# EAGLE design tccs_reader (EAGLE 5.11)
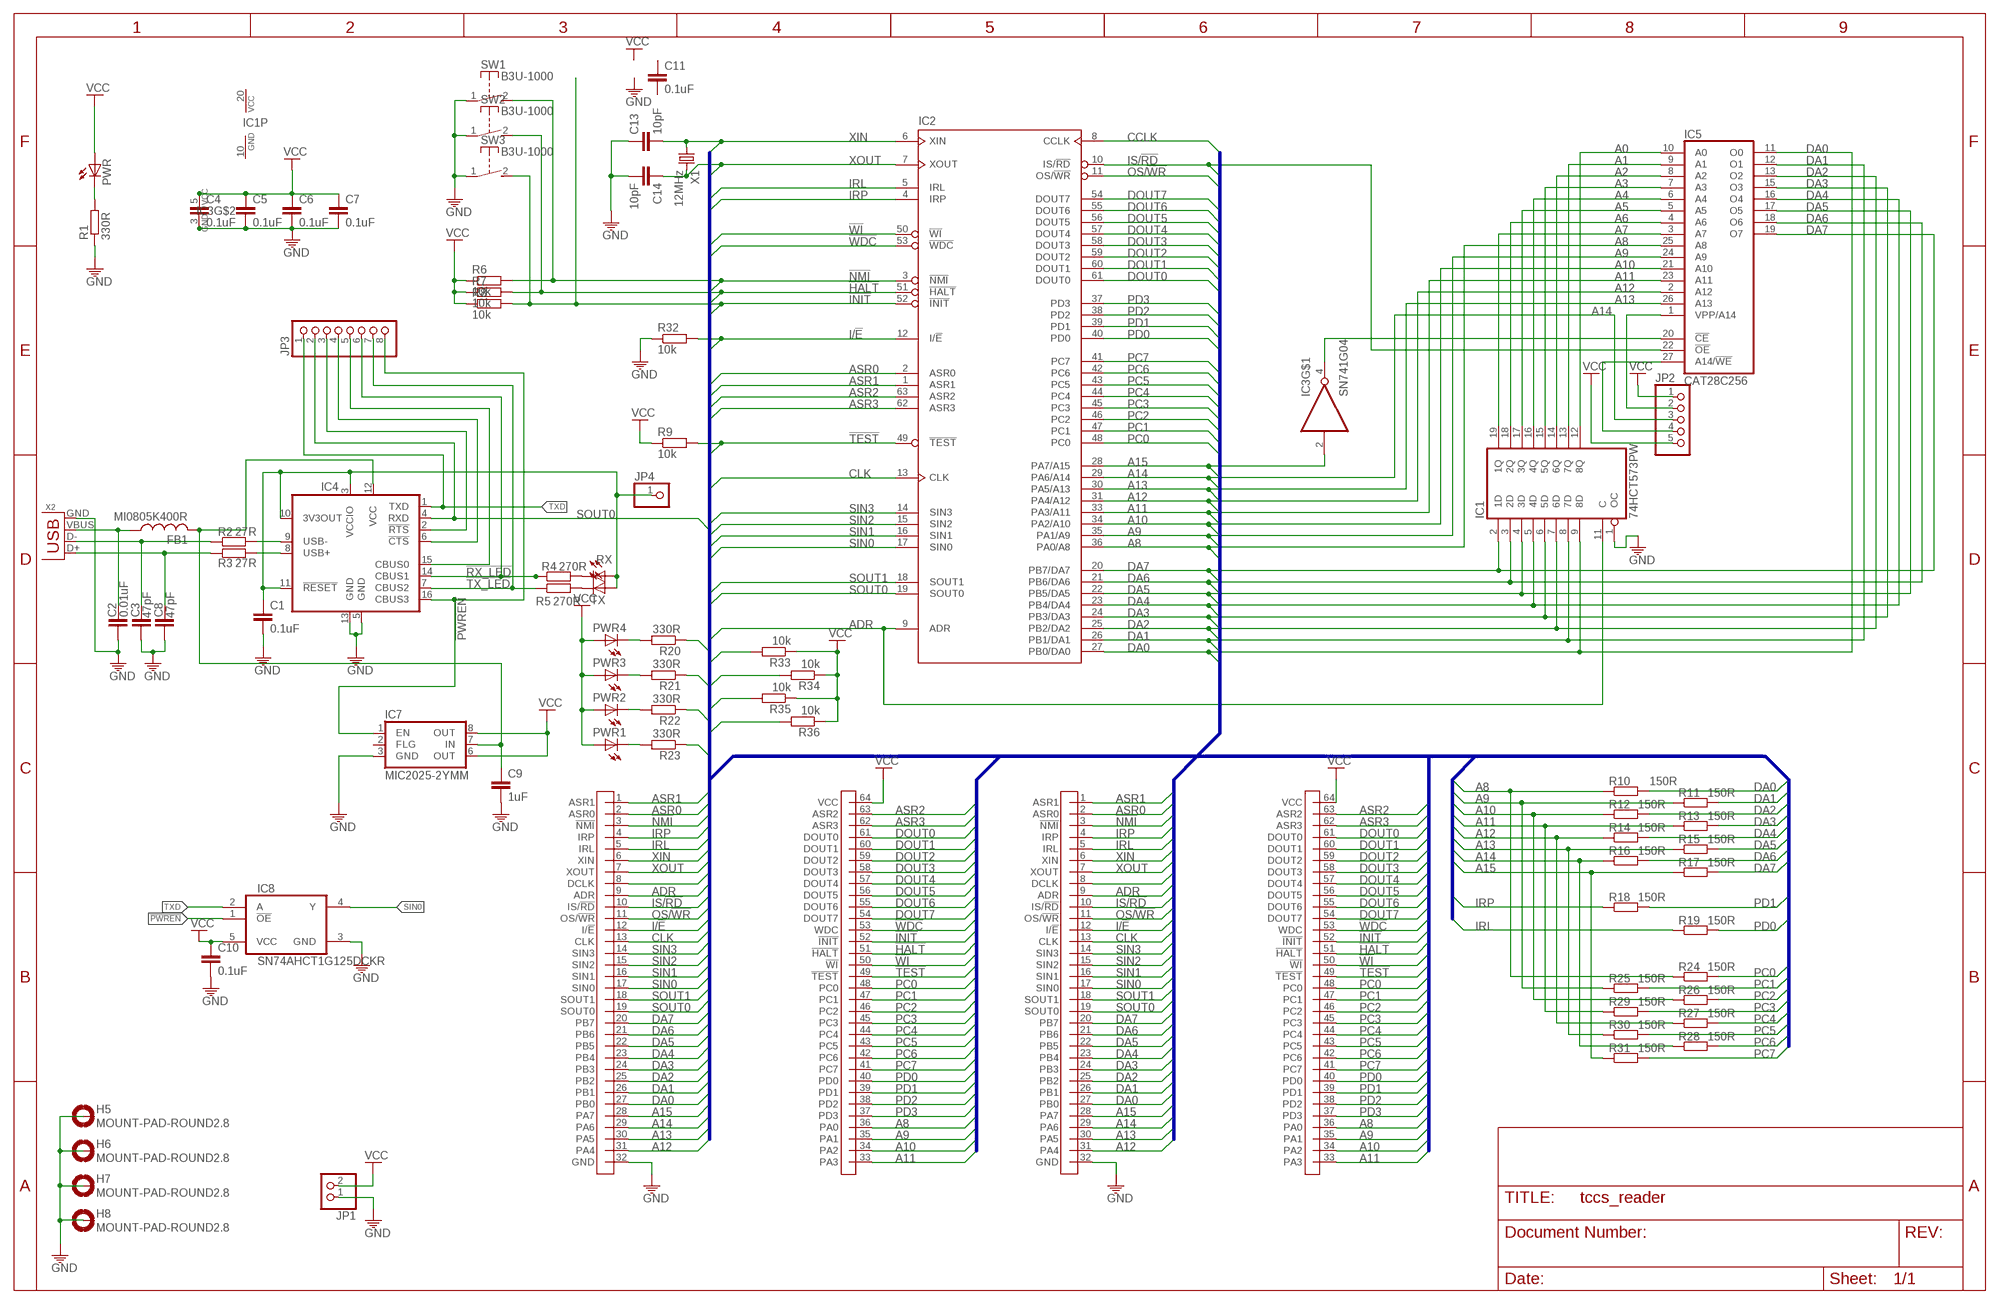
[diagram p0: schematic, sheet 1]

## Parts
C1  0.1uF  C-EUC0603  [C0603]
C2  0.01uF  C-EUC0603  [C0603]
C3  47pF  C-EUC0603  [C0603]
C4  0.1uF  C-EUC0603  [C0603]
C5  0.1uF  C-EUC0603  [C0603]
C6  0.1uF  C-EUC0603  [C0603]
C7  0.1uF  C-EUC0603  [C0603]
C8  47pF  C-EUC0603  [C0603]
C9  1uF  C-EUC0603  [C0603]
C10  0.1uF  C-EUC0603  [C0603]
C11  0.1uF  C-EUC0603  [C0603]
C13  10pF  C-EUC0603  [C0603]
C14  10pF  C-EUC0603  [C0603]
FB1  MI0805K400R  [R0805]
H5  MOUNT-PAD-ROUND2.8  [2,8-PAD]
H6  MOUNT-PAD-ROUND2.8  [2,8-PAD]
H7  MOUNT-PAD-ROUND2.8  [2,8-PAD]
H8  MOUNT-PAD-ROUND2.8  [2,8-PAD]
IC1  74HCT573PW  [PW_R-PDSO-G20]
IC2  D151803-9661  [SDIP-64]
IC3  SN741G04  [DCK_R-PDSO-G5]
IC4  IC_FT230X-SSOP-16  [SSOP-16-FTDI]
IC5  CAT28C256  [PDIP28]
IC6  D151803-HEADER  [SDIP-64-HEADER]
IC7  MIC2025-2YMM  [MSOP8]
IC8  SN74AHCT1G125DCKR  [DCK_R-PDSO-G5]
JP1  PINHD-1X2  [1X02]
JP2  PINHD-1X5  [1X05]
JP3  PINHD-1X8  [1X08]
JP4  PINHD-1X1  [1X01]
PWR  LEDCHIP-LED0603  [CHIP-LED0603]
PWR1  LEDCHIP-LED0603  [CHIP-LED0603]
PWR2  LEDCHIP-LED0603  [CHIP-LED0603]
PWR3  LEDCHIP-LED0603  [CHIP-LED0603]
PWR4  LEDCHIP-LED0603  [CHIP-LED0603]
R1  330R  R-EU_R0603  [R0603]
R2  27R  R-EU_R0603  [R0603]
R3  27R  R-EU_R0603  [R0603]
R4  270R  R-EU_R0603  [R0603]
R5  270R  R-EU_R0603  [R0603]
R6  10k  R-EU_R0603  [R0603]
R7  10k  R-EU_R0603  [R0603]
R8  10k  R-EU_R0603  [R0603]
R9  10k  R-EU_R0603  [R0603]
R10  150R  R-EU_R0603  [R0603]
R11  150R  R-EU_R0603  [R0603]
R12  150R  R-EU_R0603  [R0603]
R13  150R  R-EU_R0603  [R0603]
R14  150R  R-EU_R0603  [R0603]
R15  150R  R-EU_R0603  [R0603]
R16  150R  R-EU_R0603  [R0603]
R17  150R  R-EU_R0603  [R0603]
R18  150R  R-EU_R0603  [R0603]
R19  150R  R-EU_R0603  [R0603]
R20  330R  R-EU_R0603  [R0603]
R21  330R  R-EU_R0603  [R0603]
R22  330R  R-EU_R0603  [R0603]
R23  330R  R-EU_R0603  [R0603]
R24  150R  R-EU_R0603  [R0603]
R25  150R  R-EU_R0603  [R0603]
R26  150R  R-EU_R0603  [R0603]
R27  150R  R-EU_R0603  [R0603]
R28  150R  R-EU_R0603  [R0603]
R29  150R  R-EU_R0603  [R0603]
R30  150R  R-EU_R0603  [R0603]
R31  150R  R-EU_R0603  [R0603]
R32  10k  R-EU_R0603  [R0603]
R33  10k  R-EU_R0603  [R0603]
R34  10k  R-EU_R0603  [R0603]
R35  10k  R-EU_R0603  [R0603]
R36  10k  R-EU_R0603  [R0603]
RX  LEDCHIP-LED0603  [CHIP-LED0603]
SW1  B3U-1000  [B3U-1000]
SW2  B3U-1000  [B3U-1000]
SW3  B3U-1000  [B3U-1000]
TX  LEDCHIP-LED0603  [CHIP-LED0603]
U$3  SDIP64-ZIF  [SDIP-64-ZIF]
X1  12MHz  CRYSTAL5X3  [CRYSTAL-SMD-5X3]
X2  USB-B-H  [USB-B-H]

## Nets
!HALT: IC2.51(:!HALT) IC6.51(!HALT) R7.2 SW2.2(S) U$3.51(!HALT)
!INIT: IC2.52(:!INIT) IC6.52(!INIT) R8.2 SW3.2(S) U$3.52(!INIT)
!NMI: IC2.3(:!NMI) IC6.3(!NMI) R6.2 SW1.2(S) U$3.3(!NMI)
!PWREN: IC4.16(CBUS3) IC7.1(EN) IC8.1(!OE) JP3.8
!RX_LED: IC4.14(CBUS1) JP3.6 R4.1
!TEST: IC2.49(:!TEST) IC6.49(!TEST) R9.2 U$3.49(!TEST)
!TX_LED: IC4.7(CBUS2) JP3.7 R5.1
!WDC: IC2.53(:!WDC) IC6.53(WDC) U$3.53(WDC)
!WI: IC2.50(:!WI) IC6.50(!WI) U$3.50(!WI)
A0: IC1.12(8Q) IC5.10(A0)
A1: IC1.13(7Q) IC5.9(A1)
A2: IC1.14(6Q) IC5.8(A2)
A3: IC1.15(5Q) IC5.7(A3)
A4: IC1.16(4Q) IC5.6(A4)
A5: IC1.17(3Q) IC5.5(A5)
A6: IC1.18(2Q) IC5.4(A6)
A7: IC1.19(1Q) IC5.3(A7)
A8: IC2.36(:PA0/A8) IC5.25(A8) IC6.36(PA0) R10.1 R24.1 U$3.36(PA0)
A9: IC2.35(:PA1/A9) IC5.24(A9) IC6.35(PA1) R11.1 R25.1 U$3.35(PA1)
A10: IC2.34(:PA2/A10) IC5.21(A10) IC6.34(PA2) R12.1 R26.1 U$3.34(PA2)
A11: IC2.33(:PA3/A11) IC5.23(A11) IC6.33(PA3) R13.1 R29.1 U$3.33(PA3)
A12: IC2.31(:PA4/A12) IC5.2(A12) IC6.31(PA4) R14.1 R27.1 U$3.31(PA4)
A13: IC2.30(:PA5/A13) IC5.26(A13) IC6.30(PA5) R15.1 R30.1 U$3.30(PA5)
A14: IC2.29(:PA6/A14) IC6.29(PA6) JP2.3 R16.1 R28.1 U$3.29(PA6)
A15: IC2.28(:PA7/A15) IC3.2(I) IC6.28(PA7) R17.1 R31.1 U$3.28(PA7)
ADR: IC1.11(C) IC2.9(:ADR) IC6.9(ADR) U$3.9(ADR)
ASR0: IC2.2(:ASR0) IC6.2(ASR0) U$3.2(ASR0)
ASR1: IC2.1(:ASR1) IC6.1(ASR1) U$3.1(ASR1)
ASR2: IC2.63(:ASR2) IC6.63(ASR2) U$3.63(ASR2)
ASR3: IC2.62(:ASR3) IC6.62(ASR3) U$3.62(ASR3)
CCLK: IC2.8(:CCLK) IC6.8(DCLK) U$3.8(DCLK)
CLK: IC2.13(:CLK) IC6.13(CLK) U$3.13(CLK)
DA0: IC1.9(8D) IC2.27(:PB0/DA0) IC5.11(O0) IC6.27(PB0) R10.2 U$3.27(PB0)
DA1: IC1.8(7D) IC2.26(:PB1/DA1) IC5.12(O1) IC6.26(PB1) R11.2 U$3.26(PB1)
DA2: IC1.7(6D) IC2.25(:PB2/DA2) IC5.13(O2) IC6.25(PB2) R12.2 U$3.25(PB2)
DA3: IC1.6(5D) IC2.24(:PB3/DA3) IC5.15(O3) IC6.24(PB3) R13.2 U$3.24(PB3)
DA4: IC1.5(4D) IC2.23(:PB4/DA4) IC5.16(O4) IC6.23(PB4) R14.2 U$3.23(PB4)
DA5: IC1.4(3D) IC2.22(:PB5/DA5) IC5.17(O5) IC6.22(PB5) R15.2 U$3.22(PB5)
DA6: IC1.3(2D) IC2.21(:PB6/DA6) IC5.18(O6) IC6.21(PB6) R16.2 U$3.21(PB6)
DA7: IC1.2(1D) IC2.20(:PB7/DA7) IC5.19(O7) IC6.20(PB7) R17.2 U$3.20(PB7)
DOUT0: IC2.61(:DOUT0) IC6.61(DOUT0) R20.1 U$3.61(DOUT0)
DOUT1: IC2.60(:DOUT1) IC6.60(DOUT1) R21.1 U$3.60(DOUT1)
DOUT2: IC2.59(:DOUT2) IC6.59(DOUT2) R22.1 U$3.59(DOUT2)
DOUT3: IC2.58(:DOUT3) IC6.58(DOUT3) R23.1 U$3.58(DOUT3)
DOUT4: IC2.57(:DOUT4) IC6.57(DOUT4) R33.2 U$3.57(DOUT4)
DOUT5: IC2.56(:DOUT5) IC6.56(DOUT5) R34.2 U$3.56(DOUT5)
DOUT6: IC2.55(:DOUT6) IC6.55(DOUT6) R35.2 U$3.55(DOUT6)
DOUT7: IC2.54(:DOUT7) IC6.54(DOUT7) R36.2 U$3.54(DOUT7)
GND: C1.2 C2.2 C3.2 C4.2 C5.2 C6.2 C7.2 C8.2 C9.2 C10.2 C13.1 C14.2 H5.B2,8(MOUNT) H6.B2,8(MOUNT) H7.B2,8(MOUNT) H8.B2,8(MOUNT) IC1.1(OC) IC3.3(GND) IC4.5(GND) IC4.13(GND) IC6.32(GND) IC7.3(GND) IC8.3(GND) JP1.1 R1.1 R32.1 SW1.1(P) SW2.1(P) SW3.1(P) U$3.32(GND) X2.GND
I/!E: IC2.12(:I/!E) IC6.12(I/!E) R32.2 U$3.12(I/!E)
IRL: IC2.5(:IRL) IC6.5(IRL) R19.1 U$3.5(IRL)
IRP: IC2.4(:IRP) IC6.4(IRP) R18.1 U$3.4(IRP)
IS/!RD: IC2.10(:IS/!RD) IC5.22(!OE) IC6.10(IS/!RD) U$3.10(IS/!RD)
N$3: IC4.9(USB-) R2.2
N$4: IC4.8(USB+) R3.2
N$5: C3.1 R2.1 X2.D-
N$6: C8.1 R3.1 X2.D+
N$8: PWR1.C R23.2
N$9: R4.2 RX.C
N$10: R5.2 TX.C
N$11: IC3.4(O) IC5.20(!CE)
N$12: C2.1 FB1.1 X2.VBUS
N$13: IC5.27(A14/!WE) JP2.4
N$14: PWR2.C R22.2
N$15: PWR3.C R21.2
N$16: PWR4.C R20.2
N$17: IC5.1(VPP/A14) JP2.2
N$19: IC4.2(!RTS) JP3.3
N$20: IC4.6(!CTS) JP3.4
N$21: IC4.15(CBUS0) JP3.5
N$43: PWR.C R1.2
OS/!WR: IC2.11(:OS/!WR) IC6.11(OS/!WR) U$3.11(OS/!WR)
PC0: IC2.48(:PC0) IC6.48(PC0) R24.2 U$3.48(PC0)
PC1: IC2.47(:PC1) IC6.47(PC1) R25.2 U$3.47(PC1)
PC2: IC2.46(:PC2) IC6.46(PC2) R26.2 U$3.46(PC2)
PC3: IC2.45(:PC3) IC6.45(PC3) R29.2 U$3.45(PC3)
PC4: IC2.44(:PC4) IC6.44(PC4) R27.2 U$3.44(PC4)
PC5: IC2.43(:PC5) IC6.43(PC5) R30.2 U$3.43(PC5)
PC6: IC2.42(:PC6) IC6.42(PC6) R28.2 U$3.42(PC6)
PC7: IC2.41(:PC7) IC6.41(PC7) R31.2 U$3.41(PC7)
PD0: IC2.40(:PD0) IC6.40(PD0) R19.2 U$3.40(PD0)
PD1: IC2.39(:PD1) IC6.39(PD1) R18.2 U$3.39(PD1)
PD2: IC2.38(:PD2) IC6.38(PD2) U$3.38(PD2)
PD3: IC2.37(:PD3) IC6.37(PD3) U$3.37(PD3)
SIN0: IC2.17(:SIN0) IC6.17(SIN0) IC8.4(Y) U$3.17(SIN0)
SIN1: IC2.16(:SIN1) IC6.16(SIN1) U$3.16(SIN1)
SIN2: IC2.15(:SIN2) IC6.15(SIN2) U$3.15(SIN2)
SIN3: IC2.14(:SIN3) IC6.14(SIN3) U$3.14(SIN3)
SOUT0: IC2.19(:SOUT0) IC4.4(RXD) IC6.19(SOUT0) JP3.2 U$3.19(SOUT0)
SOUT1: IC2.18(:SOUT1) IC6.18(SOUT1) U$3.18(SOUT1)
TXD: IC4.1(TXD) IC8.2(A) JP3.1
VCC: C4.1 C5.1 C6.1 C7.1 C10.1 IC3.5(VCC) IC6.64(VCC) IC7.6(OUT) IC7.8(OUT) IC8.5(VCC) JP1.2 JP2.1 JP2.5 PWR1.A PWR2.A PWR3.A PWR4.A PWR.A R6.1 R7.1 R8.1 R9.1 R33.1 R34.1 R35.1 R36.1 U$3.64(VCC)
VCC_3V3: C1.1 IC4.3(VCCIO) IC4.10(3V3OUT) IC4.11(!RESET) JP4.1 RX.A TX.A
VCC_USB: C9.1 FB1.2 IC4.12(VCC) IC7.7(IN)
XIN: C13.2 IC2.6(:XIN) IC6.6(XIN) U$3.6(XIN) X1.1
XOUT: C14.1 IC2.7(:XOUT) IC6.7(XOUT) U$3.7(XOUT) X1.3
Unconnected: C11.1 C11.2 IC7.2(FLG)

## Buses
CPU:P[1..64],XIN,XOUT,IRP,IRL,!WI,!WDC,!NMI,!HALT,!INIT,I/!E,ASR[0..3],!TEST,CLK,SIN[0..3],SOUT[0..1],ADR,CCLK,IS/!RD,OS/!WR,DOUT[0..7],PD[0..3],PC[0..7],A[8..15],DA[0..7]

## Power pins joined to a net without a drawn wire
GND: IC1.10(GND) IC2.32(P:GND) IC5.14(GND)
VCC: IC1.20(VCC) IC2.64(P:VCC) IC5.28(VCC)

## Library data of the parts
C1-C11 C13 C14 = tccs_reader:C-EU: CAPACITOR, European symbol
FB1 = tccs_reader:MI0805K400R
H5-H8 = holes:MOUNT-PAD-ROUND: MOUNTING PAD, round
IC1 = tccs_reader:74*573: 8-bit D latch BUS DRIVER
IC2 = tccs_reader:D151803-9661
IC3 = tccs_reader:SN74*1G04
IC4 = tccs_reader:IC_FT230X: BASIC USB to UART IC
IC5 = tccs_reader:CAT28C256
IC6 = tccs_reader:D151803-HEADER
IC7 = tccs_reader:MIC2025-2
IC8 = tccs_reader:SN74AHCT1G125
JP1 = pinhead:PINHD-1X2: PIN HEADER
JP2 = pinhead:PINHD-1X5: PIN HEADER
JP3 = pinhead:PINHD-1X8: PIN HEADER
JP4 = pinhead:PINHD-1X1: PIN HEADER
PWR PWR1-PWR4 RX TX = tccs_reader:LED: LED OSRAM: - CHIPLED LG R971, LG N971, LY N971, LG Q971, LY Q971, LO R971, LY R971 LH N974, LH R974 LS Q976, LO Q976, LY Q976 LO Q996 - Hyper CHIPLED LW Q18S LB Q993, LB Q99A, LB R99A - SideLED LS A670, LO A670, LY A670, LG A670, LP A670 LB A673, LV A673, LT A673, LW A673 LH A674 LY A675 LS A676, LA A676, LO A676, LY A676, LW A676 LS A679, LY A679, LG A679 - Hyper Micro SIDELED® LS Y876, LA Y876, LO Y876, LY Y876 LT Y87S - SmartLED LW L88C, LW L88S LB L89C, LB L89S, LG L890 LS L89K, LO L89K, LY L89K LS L896, LA L896, LO L896, LY L896 - TOPLED LS T670, LO T670, LY T670, LG T670, LP T670 LSG T670, LSP T670, LSY T670, LOP T670, LYG T670 LG T671, LOG T671, LSG T671 LB T673, LV T673, LT T673, LW T673 LH T674 LS T676, LA T676, LO T676, LY T676, LB T676, LH T676, LSB T676, LW T676 LB T67C, LV T67C, LT T67C, LS T67K, LO T67K, LY T67K, LW E67C LS E67B, LA E67B, LO E67B, LY E67B, LB E67C, LV E67C, LT E67C LW T67C LS T679, LY T679, LG T679 LS T770, LO T770, LY T770, LG T770, LP T770 LB T773, LV T773, LT T773, LW T773 LH T774 LS E675, LA E675, LY E675, LS T675 LS T776, LA T776, LO T776, LY T776, LB T776 LHGB T686 LT T68C, LB T68C - Hyper Mini TOPLED® LB M676 - Mini TOPLED Santana® LG M470 LS M47K, LO M47K, LY M47K Source: http://www.osram.convergy.de LUXEON: - LUMILED® LXK2-PW12-R00, LXK2-PW12-S00, LXK2-PW14-U00, LXK2-PW14-V00 LXK2-PM12-R00, LXK2-PM12-S00, LXK2-PM14-U00 LXK2-PE12-Q00, LXK2-PE12-R00, LXK2-PE12-S00, LXK2-PE14-T00, LXK2-PE14-U00 LXK2-PB12-K00, LXK2-PB12-L00, LXK2-PB12-M00, LXK2-PB14-N00, LXK2-PB14-P00, LXK2-PB14-Q00 LXK2-PR12-L00, LXK2-PR12-M00, LXK2-PR14-Q00, LXK2-PR14-R00 LXK2-PD12-Q00, LXK2-PD12-R00, LXK2-PD12-S00 LXK2-PH12-R00, LXK2-PH12-S00 LXK2-PL12-P00, LXK2-PL12-Q00, LXK2-PL12-R00 Source: www.luxeon.com KINGBRIGHT: KA-3528ASYC Source: www.kingbright.com
R1-R36 = tccs_reader:R-EU_: RESISTOR, European symbol
SW1-SW3 = tccs_reader:B3U-1000
U$3 = tccs_reader:SDIP64-ZIF
X1 = tccs_reader:CRYSTAL: Crystals Various standard crystals. Proven footprints. Spark Fun Electronics SKU : COM-00534
X2 = tccs_reader:USB: USB Connectors

## Board
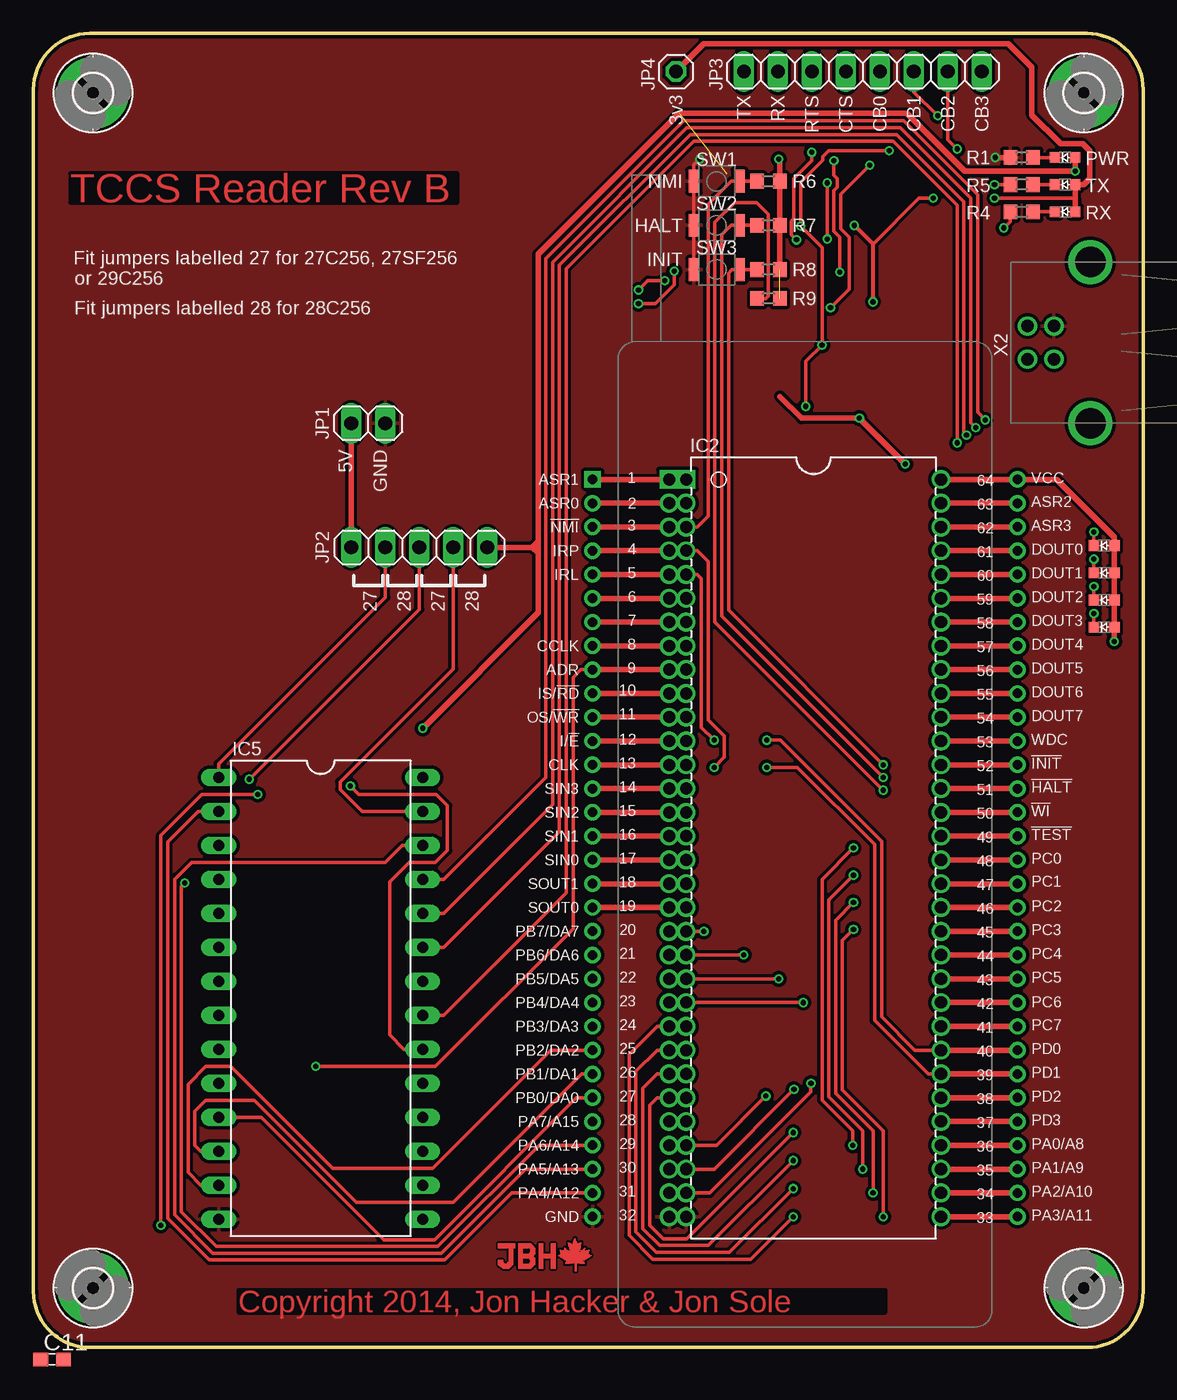
[diagram p1: board, top side]
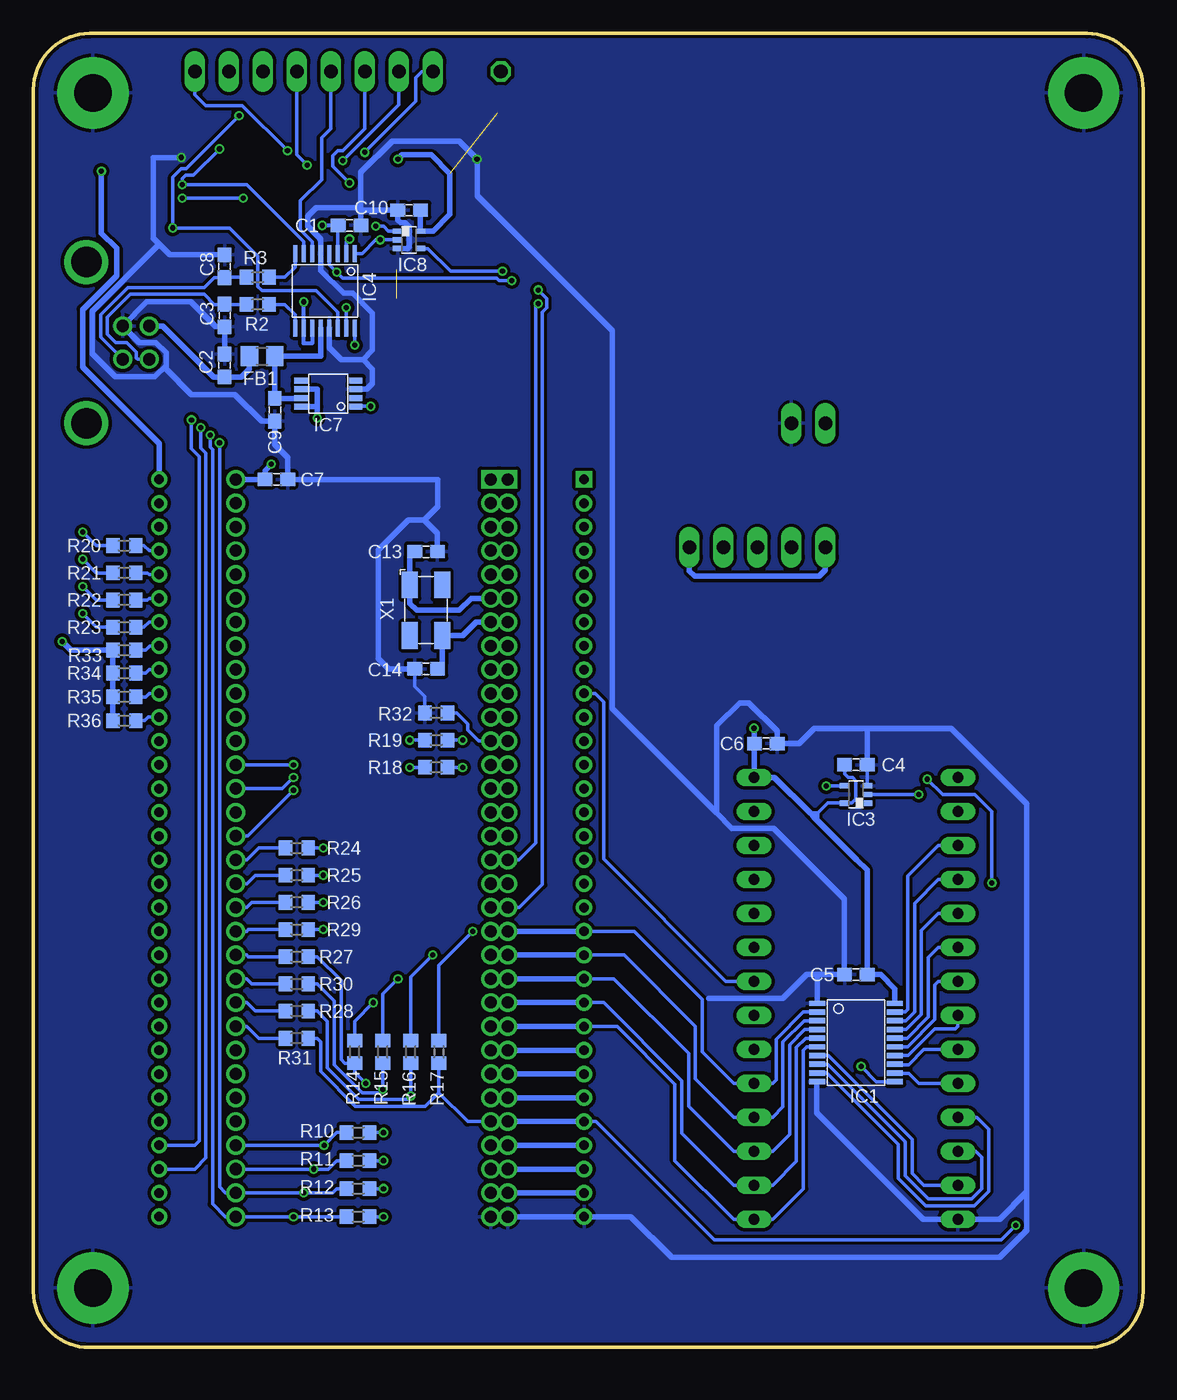
[diagram p2: board, bottom side, seen from below]

Size 82.93 x 98.23 mm. Coordinates in mm from the lower left corner, seen from the top.
Outline: 82.93,4.19 arc-90 78.74,0 4.19,0 arc-90 0,4.19 0,94.04 arc-90 4.19,98.23 78.74,98.23 arc-90 82.93,94.04 82.93,4.19
Copper layers (1*16): Top 0.035mm / dielectric 1.5mm / Bottom 0.035mm
Design rules "elecrow": minimum track width 6mil, minimum drill 12mil, track to track 6mil, track to pad 6mil, pad to pad 6mil, via to via 6mil, smd to smd 0mil, copper to edge 10mil, drill to drill 10mil, minimum pad ring 10mil, minimum via ring 6mil, stop-mask expansion 2mil, vias tented up to drill 100mil, thermal gap 10mil

### Footprints (pad centres in the part's own frame; a part is rotated, then mirrored left to right if it is on the bottom)
C0603 = smd 1.1 x 1: 1 -0.85,0; 2 0.85,0
R0805 = smd 1.3 x 1.5: 1 -0.95,0; 2 0.95,0
2,8-PAD = drill 2.8 pad 5.334 round: B2,8 0,0
PW_R-PDSO-G20 = smd 0.4 x 1.2: 1 -2.925,-2.9; 2 -2.275,-2.9; 3 -1.625,-2.9; 4 -0.975,-2.9; 5 -0.325,-2.9; 6 0.325,-2.9; 7 0.975,-2.9; 8 1.625,-2.9; 9 2.275,-2.9; 10 2.925,-2.9; 11 2.925,2.9; 12 2.275,2.9; 13 1.625,2.9; 14 0.975,2.9; 15 0.325,2.9; 16 -0.325,2.9; 17 -0.975,2.9; 18 -1.625,2.9; 19 -2.275,2.9; 20 -2.925,2.9
SDIP-64 = drill 0.9 square: 1 -27.559,-9.525 | drill 0.9 round: 2 -25.781,-9.525; 3 -24.003,-9.525; 4 -22.225,-9.525; 5 -20.447,-9.525; 6 -18.669,-9.525; 7 -16.891,-9.525; 8 -15.113,-9.525; 9 -13.335,-9.525; 10 -11.557,-9.525; 11 -9.779,-9.525; 12 -8.001,-9.525; 13 -6.223,-9.525; 14 -4.445,-9.525; 15 -2.667,-9.525; 16 -0.889,-9.525; 17 0.889,-9.525; 18 2.667,-9.525; 19 4.445,-9.525; 20 6.223,-9.525; 21 8.001,-9.525; 22 9.779,-9.525; 23 11.557,-9.525; 24 13.335,-9.525; 25 15.113,-9.525; 26 16.891,-9.525; 27 18.669,-9.525; 28 20.447,-9.525; 29 22.225,-9.525; 30 24.003,-9.525; 31 25.781,-9.525; 32 27.559,-9.525; 33 27.559,9.525; 34 25.781,9.525; 35 24.003,9.525; 36 22.225,9.525; 37 20.447,9.525; 38 18.669,9.525; 39 16.891,9.525; 40 15.113,9.525; 41 13.335,9.525; 42 11.557,9.525; 43 9.779,9.525; 44 8.001,9.525; 45 6.223,9.525; 46 4.445,9.525; 47 2.667,9.525; 48 0.889,9.525; 49 -0.889,9.525; 50 -2.667,9.525; 51 -4.445,9.525; 52 -6.223,9.525; 53 -8.001,9.525; 54 -9.779,9.525; 55 -11.557,9.525; 56 -13.335,9.525; 57 -15.113,9.525; 58 -16.891,9.525; 59 -18.669,9.525; 60 -20.447,9.525; 61 -22.225,9.525; 62 -24.003,9.525; 63 -25.781,9.525; 64 -27.559,9.525
DCK_R-PDSO-G5 = smd 0.4 x 0.7: 1 -0.65,-0.85; 2 0,-0.85; 3 0.65,-0.85; 4 0.65,0.85; 5 -0.65,0.85
SSOP-16-FTDI = smd 0.32 x 1.26: 1 -2.223,-2.779; 2 -1.588,-2.779; 3 -0.953,-2.779; 4 -0.318,-2.779; 5 0.317,-2.779; 6 0.952,-2.779; 7 1.587,-2.779; 8 2.222,-2.779; 9 2.222,2.779; 10 1.587,2.779; 11 0.952,2.779; 12 0.317,2.779; 13 -0.318,2.779; 14 -0.953,2.779; 15 -1.588,2.779; 16 -2.223,2.779
PDIP28 = drill 0.813 long: 1 -16.51,-7.62; 2 -13.97,-7.62; 3 -11.43,-7.62; 4 -8.89,-7.62; 5 -6.35,-7.62; 6 -3.81,-7.62; 7 -1.27,-7.62; 8 1.27,-7.62; 9 3.81,-7.62; 10 6.35,-7.62; 11 8.89,-7.62; 12 11.43,-7.62; 13 13.97,-7.62; 14 16.51,-7.62; 15 16.51,7.62; 16 13.97,7.62; 17 11.43,7.62; 18 8.89,7.62; 19 6.35,7.62; 20 3.81,7.62; 21 1.27,7.62; 22 -1.27,7.62; 23 -3.81,7.62; 24 -6.35,7.62; 25 -8.89,7.62; 26 -11.43,7.62; 27 -13.97,7.62; 28 -16.51,7.62
SDIP-64-HEADER = drill 0.711 square: 1 -27.559,-15.875 | drill 0.711 round: 2 -25.781,-15.875; 3 -24.003,-15.875; 4 -22.225,-15.875; 5 -20.447,-15.875; 6 -18.669,-15.875; 7 -16.891,-15.875; 8 -15.113,-15.875; 9 -13.335,-15.875; 10 -11.557,-15.875; 11 -9.779,-15.875; 12 -8.001,-15.875; 13 -6.223,-15.875; 14 -4.445,-15.875; 15 -2.667,-15.875; 16 -0.889,-15.875; 17 0.889,-15.875; 18 2.667,-15.875; 19 4.445,-15.875; 20 6.223,-15.875; 21 8.001,-15.875; 22 9.779,-15.875; 23 11.557,-15.875; 24 13.335,-15.875; 25 15.113,-15.875; 26 16.891,-15.875; 27 18.669,-15.875; 28 20.447,-15.875; 29 22.225,-15.875; 30 24.003,-15.875; 31 25.781,-15.875; 32 27.559,-15.875; 33 27.559,15.875; 34 25.781,15.875; 35 24.003,15.875; 36 22.225,15.875; 37 20.447,15.875; 38 18.669,15.875; 39 16.891,15.875; 40 15.113,15.875; 41 13.335,15.875; 42 11.557,15.875; 43 9.779,15.875; 44 8.001,15.875; 45 6.223,15.875; 46 4.445,15.875; 47 2.667,15.875; 48 0.889,15.875; 49 -0.889,15.875; 50 -2.667,15.875; 51 -4.445,15.875; 52 -6.223,15.875; 53 -8.001,15.875; 54 -9.779,15.875; 55 -11.557,15.875; 56 -13.335,15.875; 57 -15.113,15.875; 58 -16.891,15.875; 59 -18.669,15.875; 60 -20.447,15.875; 61 -22.225,15.875; 62 -24.003,15.875; 63 -25.781,15.875; 64 -27.559,15.875
MSOP8 = smd 0.45 x 1: 1 -0.975,-2.05; 2 -0.325,-2.05; 3 0.325,-2.05; 4 0.975,-2.05; 5 0.975,2.05; 6 0.325,2.05; 7 -0.325,2.05; 8 -0.975,2.05
1X02 = drill 1.016 long: 1 -1.27,0; 2 1.27,0
1X05 = drill 1.016 long: 1 -5.08,0; 2 -2.54,0; 3 0,0; 4 2.54,0; 5 5.08,0
1X08 = drill 1.016 long: 1 -8.89,0; 2 -6.35,0; 3 -3.81,0; 4 -1.27,0; 5 1.27,0; 6 3.81,0; 7 6.35,0; 8 8.89,0
1X01 = drill 1.016 octagon: 1 0,0
CHIP-LED0603 = smd 0.8 x 0.8: A 0,-0.75; C 0,0.75
R0603 = smd 1 x 1.1: 1 -0.85,0; 2 0.85,0
B3U-1000 = smd 0.8 x 1.7: 1 -1.7,0; 2 1.7,0
SDIP-64-ZIF = drill 0.9 square: 1 -27.559,-10.16 | drill 0.9 round: 2 -25.781,-10.16; 3 -24.003,-10.16; 4 -22.225,-10.16; 5 -20.447,-10.16; 6 -18.669,-10.16; 7 -16.891,-10.16; 8 -15.113,-10.16; 9 -13.335,-10.16; 10 -11.557,-10.16; 11 -9.779,-10.16; 12 -8.001,-10.16; 13 -6.223,-10.16; 14 -4.445,-10.16; 15 -2.667,-10.16; 16 -0.889,-10.16; 17 0.889,-10.16; 18 2.667,-10.16; 19 4.445,-10.16; 20 6.223,-10.16; 21 8.001,-10.16; 22 9.779,-10.16; 23 11.557,-10.16; 24 13.335,-10.16; 25 15.113,-10.16; 26 16.891,-10.16; 27 18.669,-10.16; 28 20.447,-10.16; 29 22.225,-10.16; 30 24.003,-10.16; 31 25.781,-10.16; 32 27.559,-10.16; 33 27.559,10.16; 34 25.781,10.16; 35 24.003,10.16; 36 22.225,10.16; 37 20.447,10.16; 38 18.669,10.16; 39 16.891,10.16; 40 15.113,10.16; 41 13.335,10.16; 42 11.557,10.16; 43 9.779,10.16; 44 8.001,10.16; 45 6.223,10.16; 46 4.445,10.16; 47 2.667,10.16; 48 0.889,10.16; 49 -0.889,10.16; 50 -2.667,10.16; 51 -4.445,10.16; 52 -6.223,10.16; 53 -8.001,10.16; 54 -9.779,10.16; 55 -11.557,10.16; 56 -13.335,10.16; 57 -15.113,10.16; 58 -16.891,10.16; 59 -18.669,10.16; 60 -20.447,10.16; 61 -22.225,10.16; 62 -24.003,10.16; 63 -25.781,10.16; 64 -27.559,10.16
CRYSTAL-SMD-5X3 = smd 2 x 1.2: 1 -1.9,-1.2; 2 1.9,-1.2; 3 1.9,1.2; 4 -1.9,1.2
USB-B-H = drill 0.914 round: D+ 0,1.25; D- 1.981,1.25; GND 0,-1.25; VBUS 1.981,-1.25 | drill 2.286 round: P$1 -2.718,-6.02; P$2 -2.718,6.02

### Placement (x,y rotation side)
C1  59.31,83.88 0 bottom
C2  68.64,73.41 90 bottom
C3  68.64,77.15 270 bottom
C4  21.46,43.56 0 bottom
C5  21.46,27.88 180 bottom
C6  28.19,45.15 0 bottom
C7  64.77,64.9 0 bottom
C8  68.64,80.84 90 bottom
C9  64.9,70.1 270 bottom
C10  54.86,85.03 180 bottom
C11  1.4,-0.89 0 top
C13  53.59,59.5 180 bottom
C14  53.59,50.74 180 bottom
FB1  65.85,74.1 0 bottom
H5  78.49,93.79 0 top
H6  4.45,93.79 0 top
H7  78.49,4.44 270 top
H8  4.45,4.44 270 top
IC1  21.46,22.8 270 bottom
IC2  58.29,37.34 270 top
IC3  21.46,41.34 90 bottom
IC4  61.15,78.99 180 bottom
IC5  21.46,26.1 270 top
IC6  57.66,37.34 270 top
IC7  60.9,71.31 90 bottom
IC8  54.86,82.8 270 bottom
JP1  25.02,69.09 180 top
JP2  28.83,59.82 0 top
JP3  61.98,95.38 0 top
JP4  48.01,95.38 0 top
PWR  77.09,88.96 90 top
PWR1  80.01,53.85 90 top
PWR2  80.01,55.88 90 top
PWR3  80.01,57.91 90 top
PWR4  80.01,59.94 90 top
R1  73.85,88.96 0 top
R2  66.17,77.98 0 bottom
R3  66.17,80.01 0 bottom
R4  73.85,84.9 0 top
R5  73.85,86.93 0 top
R6  54.93,87.19 180 top
R7  54.93,83.88 180 top
R8  54.93,80.58 180 top
R9  54.93,78.42 180 top
R10  58.67,16.07 0 bottom
R11  58.67,13.97 0 bottom
R12  58.67,11.87 0 bottom
R13  58.67,9.78 0 bottom
R14  58.93,22.1 90 bottom
R15  56.83,22.1 90 bottom
R16  54.74,22.1 90 bottom
R17  52.64,22.1 90 bottom
R18  52.83,43.37 180 bottom
R19  52.83,45.4 180 bottom
R20  76.14,59.94 180 bottom
R21  76.14,57.91 180 bottom
R22  76.14,55.88 180 bottom
R23  76.14,53.85 180 bottom
R24  63.25,37.34 180 bottom
R25  63.25,35.31 180 bottom
R26  63.25,33.27 180 bottom
R27  63.25,29.21 180 bottom
R28  63.25,25.15 180 bottom
R29  63.25,31.24 180 bottom
R30  63.25,27.18 180 bottom
R31  63.25,23.11 180 bottom
R32  52.83,47.43 0 bottom
R33  76.14,52.13 0 bottom
R34  76.14,50.42 0 bottom
R35  76.14,48.64 0 bottom
R36  76.14,46.86 0 bottom
RX  77.09,84.9 90 top
SW1  51.05,87.19 0 top
SW2  51.05,83.88 0 top
SW3  51.05,80.58 0 top
TX  77.09,86.93 90 top
U$1  [JBH_LOGO]  34.29,5.59 0 top
U$3  57.66,37.34 270 top
X1  53.59,55.12 270 bottom
X2  76.26,75.12 180 top

### Tracks (layer width: path | path; a pad name or v marks a point on that pad's centre or on a via)
!HALT  (via drill 0.38)
  Top 0.254: v63.5,42.61 51.43,54.67 51.43,83.19 52.13,83.88 SW2.2 R7.2
  Top 0.406: U$3.51 IC6.51
  Bottom 0.254: v63.5,42.61 64.33,41.78 U$3.51
!INIT  (via drill 0.38)
  Top 0.254: v63.5,43.56 51.94,55.12 51.94,80.33 52.2,80.58 SW3.2 R8.2
  Top 0.406: U$3.52 IC6.52
  Bottom 0.254: v63.5,43.56 U$3.52
!NMI
  Top 0.254: R6.2 SW1.2 52.13,87.19 50.42,85.47 50.42,62.17 49.59,61.34 IC2.3
  Top 0.406: IC6.3 U$3.3 IC2.3
!PWREN  (via drill 0.38)
  Top 0.254: v57.72,70.36 57.72,73.72 v58.93,74.93 58.93,82.23 v57.34,83.82 57.34,87.12 58.99,88.77 58.99,89.03 59.44,89.47 v63.95,89.47
  Bottom 0.254: v57.72,70.36 58.82,70.36 IC7.1 | IC4.16 v58.93,74.93 | IC8.1 56.4,83.45 56.77,83.82 v57.34,83.82 | v63.95,89.47 67.31,92.84 70.04,92.84 70.87,93.66 JP3.8
!RX_LED  (via drill 0.38)
  Top 0.254: R4.1 73,84.18 v72.52,83.69 | JP3.6 65.79,93.85 v67.56,92.08
  Bottom 0.254: IC4.14 60.2,77.41 61.79,78.99 65.85,78.99 66.17,79.31 66.17,81.6 68.26,83.69 v72.52,83.69 72.52,87.5 71.88,88.14 71.5,88.14 v67.56,92.08
!TEST  (via drill 0.38)
  Top 0.254: v63.5,41.66 50.93,54.23 50.93,84.14 52.39,85.6 54.04,85.6 54.93,84.71 54.93,78.61 54.74,78.42 R9.2
  Top 0.406: U$3.49 IC6.49
  Bottom 0.254: v63.5,41.66 66.93,38.23 U$3.49
!TX_LED  (via drill 0.38)
  Top 0.254: v71.82,86.93 R5.1 | v69.02,89.6 68.33,90.3 JP3.7
  Bottom 0.254: IC4.7 62.74,82.68 66.99,86.93 v71.82,86.93 71.82,87.38 71.56,87.63 70.99,87.63 v69.02,89.6
!WDC
  Top 0.406: U$3.53 IC6.53
!WI
  Top 0.406: U$3.50 IC6.50
A0
  Bottom 0.254: IC5.10 16.76,19.75 17.53,20.51 18.55,20.51 IC1.12
A1
  Bottom 0.254: IC5.9 16.38,22.29 17.53,21.15 18.54,21.15 IC1.13
A2
  Bottom 0.254: IC1.14 17.55,21.82 15.56,23.81 14.03,23.81 13.84,24 IC5.8
A3
  Bottom 0.254: IC1.15 17.59,22.48 15.56,24.51 15.56,27.11 15.3,27.37 IC5.7
A4
  Bottom 0.254: IC1.16 17.64,23.12 16.07,24.7 16.07,29.15 15.3,29.91 IC5.6
A5
  Bottom 0.254: IC1.17 17.69,23.77 16.57,24.89 16.57,31.18 15.3,32.45 IC5.5
A6
  Bottom 0.254: IC1.18 17.74,24.42 17.08,25.08 17.08,33.21 15.3,34.99 IC5.4
A7
  Bottom 0.254: IC1.19 17.79,25.07 17.59,25.27 17.59,35.24 15.3,37.53 IC5.3
A8  (via drill 0.38)
  Top 0.254: v71.12,69.34 70.55,69.91 70.55,86.17 65.02,91.69 48.58,91.69 38.29,81.41 38.29,42.61 30.67,34.99 IC5.25 | v61.28,37.34 58.93,34.99 58.93,18.48 61.21,16.19 v61.21,15.11
  Top 0.406: IC6.36 U$3.36
  Bottom 0.254: IC6.36 70.87,15.11 70.55,15.43 70.55,66.61 71.12,67.18 v71.12,69.34 | R10.1 60.26,16.07 v61.21,15.11 U$3.36 | v61.28,37.34 R24.1
A9  (via drill 0.38)
  Top 0.254: v70.42,68.77 70.04,69.15 70.04,85.91 64.77,91.19 48.83,91.19 38.8,81.15 38.8,40.58 30.67,32.45 IC5.24 | v61.28,35.31 59.44,33.46 59.44,18.73 61.98,16.19 v61.98,13.34
  Top 0.406: IC6.35 U$3.35
  Bottom 0.254: IC6.35 70.87,13.34 70.04,14.16 70.04,66.86 70.42,67.25 v70.42,68.77 | R11.1 60.26,13.97 60.9,13.34 v61.98,13.34 U$3.35 | v61.28,35.31 R25.1
A10  (via drill 0.38)
  Top 0.254: v69.02,67.63 69.02,85.41 64.26,90.17 49.34,90.17 39.81,80.64 39.81,33.97 30.67,24.83 IC5.21 | v61.28,33.27 59.94,31.94 59.94,18.99 62.74,16.19 v62.74,11.56
  Top 0.406: U$3.34 IC6.34
  Bottom 0.254: v69.02,67.63 69.02,12 68.58,11.56 U$3.34 v62.74,11.56 60.58,11.56 60.26,11.88 R12.1 | v61.28,33.27 R26.1
A11  (via drill 0.38)
  Top 0.254: v69.72,68.2 69.53,68.39 69.53,85.66 64.52,90.68 49.08,90.68 39.31,80.9 39.31,38.54 30.67,29.91 IC5.23 | v61.28,31.24 60.45,30.42 60.45,19.24 63.5,16.19 v63.5,9.78
  Top 0.406: U$3.33 IC6.33
  Bottom 0.254: v69.72,68.2 69.72,67.31 69.53,67.12 69.53,10.73 68.58,9.78 U$3.33 v63.5,9.78 R13.1 | v61.28,31.24 R29.1
A12  (via drill 0.38)
  Top 0.254: IC5.2 12.32,40.07 10.03,37.78 10.03,9.65 13.15,6.54 30.73,6.54 35.75,11.56 IC6.31 | v58.1,19.75 58.1,19.11 50.55,11.56 IC2.31
  Bottom 0.254: R27.1 61.72,29.21 59.94,27.43 59.94,21.53 59.66,21.25 R14.1 58.93,20.57 v58.1,19.75
  Bottom 0.406: IC6.31 U$3.31 IC2.31
A13  (via drill 0.38)
  Top 0.254: IC5.26 27.56,37.53 26.29,36.26 11.81,36.26 10.54,34.99 10.54,9.91 13.4,7.05 30.48,7.05 36.77,13.34 IC6.30 | v56.83,19.3 50.86,13.34 IC2.30
  Bottom 0.254: R30.1 61.72,27.18 60.45,25.91 60.45,21.15 58.36,19.05 57.09,19.05 v56.83,19.3 R15.1
  Bottom 0.406: IC6.30 U$3.30 IC2.30
A14  (via drill 0.38)
  Top 0.254: v54.74,18.8 51.05,15.11 IC2.29 | IC6.29 37.78,15.11 30.23,7.56 13.65,7.56 11.05,10.16 11.05,34.48 v11.3,34.73 | v16.13,42.48 28.83,55.18 28.83,58.8 JP2.3
  Bottom 0.254: R16.1 v54.74,18.8 54.99,18.54 58.61,18.54 60.96,20.89 60.96,24.38 61.72,25.15 R28.1 | v11.3,34.73 11.3,40.07 12.57,41.34 14.99,41.34 v16.13,42.48
  Bottom 0.406: IC6.29 U$3.29 IC2.29
A15  (via drill 0.38)
  Top 0.254: v9.53,9.14 9.53,38.29 12.57,41.34 v16.76,41.34
  Bottom 0.254: v9.53,9.14 10.61,8.06 32.07,8.06 40.89,16.89 IC6.28 | v16.76,41.34 IC3.2 | 52.64,19.05 R17.1 | 52.64,19.05 53.66,18.03 58.86,18.03 61.47,20.64 61.47,22.86 61.72,23.11 R31.1 | 52.64,19.05 50.48,16.89 IC2.28
  Bottom 0.406: IC6.28 U$3.28 IC2.28
ADR  (via drill 0.38)
  Top 0.254: IC6.9 40.89,50.67 40.32,50.1 40.32,31.31 30.04,21.02 v21.08,21.02
  Top 0.406: IC6.9 U$3.9 IC2.9
  Bottom 0.254: IC1.11 19.93,19.87 v21.08,21.02
ASR0
  Top 0.406: IC6.2 U$3.2 IC2.2
ASR1
  Top 0.406: IC6.1 U$3.1 IC2.1
ASR2
  Top 0.406: U$3.63 IC6.63
ASR3
  Top 0.406: U$3.62 IC6.62
CCLK
  Top 0.406: IC6.8 U$3.8 IC2.8
CLK
  Top 0.406: IC6.13 U$3.13 IC2.13
DA0  (via drill 0.38)
  Top 0.254: IC5.11 17.02,17.21 26.16,8.06 29.97,8.06 40.58,18.67 IC6.27 | U$3.27 46.61,18.67 46.04,18.1 46.04,9.14 47.05,8.13 48.83,8.13 v56.77,16.07
  Bottom 0.254: IC1.9 23.63,20.52 18.29,15.18 18.29,12.64 16.26,10.61 12.64,10.61 11.56,11.68 11.56,16.32 12.45,17.21 IC5.11 | v56.77,16.07 R10.2
  Bottom 0.406: IC6.27 U$3.27 IC2.27
DA1  (via drill 0.38)
  Top 0.254: IC5.12 12.51,14.67 12.07,15.11 12.07,17.65 12.89,18.48 16.51,18.48 24.13,10.86 31.37,10.86 40.96,20.45 IC6.26 | U$3.26 46.61,20.45 45.53,19.37 45.53,8.89 46.8,7.62 50.42,7.62 v56.77,13.97
  Bottom 0.254: IC1.8 23.59,21.17 17.78,15.37 17.78,12.83 16.07,11.11 12.83,11.11 12.07,11.88 12.07,14.22 12.51,14.67 IC5.12 | v56.77,13.97 R11.2
  Bottom 0.406: IC6.26 U$3.26 IC2.26
DA2  (via drill 0.38)
  Top 0.254: IC5.13 12.51,12.13 11.56,13.08 11.56,19.69 12.89,21.02 14.73,21.02 22.35,13.4 29.84,13.4 38.67,22.23 IC6.25 | U$3.25 46.61,22.23 45.02,20.64 45.02,8.64 46.55,7.11 52.01,7.11 v56.77,11.88
  Bottom 0.254: IC1.7 23.54,21.82 17.27,15.56 17.27,13.02 16.38,12.13 IC5.13 | v56.77,11.88 R12.2
  Bottom 0.406: IC6.25 U$3.25 IC2.25
DA3  (via drill 0.38)
  Top 0.254: U$3.24 46.61,24 44.51,21.91 44.51,8.38 46.29,6.6 53.59,6.6 v56.77,9.78
  Bottom 0.254: IC1.6 25.15,22.47 25.4,22.22 25.4,11.88 27.69,9.59 IC5.15 30.61,9.59 34.99,13.97 34.99,19.69 39.31,24 IC6.24 | v56.77,9.78 R13.2
  Bottom 0.406: IC6.24 U$3.24 IC2.24
DA4  (via drill 0.38)
  Top 0.254: IC2.23 v57.53,25.78
  Bottom 0.254: IC1.5 25.21,23.12 25.91,22.42 25.91,13.91 27.69,12.13 IC5.16 30.61,12.13 34.48,16 34.48,19.94 40.32,25.78 IC6.23 | R14.2 58.93,24.38 v57.53,25.78
  Bottom 0.406: IC6.23 U$3.23 IC2.23
DA5  (via drill 0.38)
  Top 0.254: IC2.22 v55.69,27.56
  Bottom 0.254: IC1.4 25.27,23.77 26.42,22.63 26.42,15.94 27.69,14.67 IC5.17 30.61,14.67 33.97,18.03 33.97,21.97 39.56,27.56 IC6.22 | R15.2 56.83,26.42 v55.69,27.56
  Bottom 0.406: IC6.22 U$3.22 IC2.22
DA6  (via drill 0.38)
  Top 0.254: IC2.21 v53.09,29.34
  Bottom 0.254: IC1.3 25.34,24.42 26.92,22.83 26.92,17.97 27.69,17.21 IC5.18 30.61,17.21 33.46,20.07 33.46,24 38.8,29.34 IC6.21 | R16.2 54.74,27.69 v53.09,29.34
  Bottom 0.406: IC6.21 U$3.21 IC2.21
DA7  (via drill 0.38)
  Top 0.254: IC2.20 v50.1,31.11
  Bottom 0.254: IC1.2 25.4,25.07 27.43,23.04 27.43,20 27.69,19.75 IC5.19 30.61,19.75 32.96,22.1 32.96,26.04 38.04,31.11 IC6.20 | R17.2 52.64,28.57 v50.1,31.11
  Bottom 0.406: IC6.20 U$3.20 IC2.20
DOUT0
  Top 0.406: U$3.61 IC6.61
  Bottom 0.254: IC6.61 74.3,59.56 74.68,59.94 R20.1
DOUT1
  Top 0.406: U$3.60 IC6.60
  Bottom 0.254: IC6.60 74.3,57.78 74.42,57.91 R21.1
DOUT2
  Top 0.406: U$3.59 IC6.59
  Bottom 0.254: IC6.59 74.3,56.01 74.42,55.88 R22.1
DOUT3
  Top 0.406: U$3.58 IC6.58
  Bottom 0.254: IC6.58 74.3,54.23 74.68,53.85 R23.1
DOUT4
  Top 0.406: U$3.57 IC6.57
  Bottom 0.254: IC6.57 74.23,52.45 74.55,52.13 R33.2
DOUT5
  Top 0.406: U$3.56 IC6.56
  Bottom 0.254: IC6.56 74.3,50.67 74.55,50.42 R34.2
DOUT6
  Top 0.406: U$3.55 IC6.55
  Bottom 0.254: IC6.55 74.3,48.89 74.55,48.64 R35.2
DOUT7
  Top 0.406: U$3.54 IC6.54
  Bottom 0.254: IC6.54 74.36,47.12 74.61,46.86 R36.2
GND  (via drill 0.38)
  Top 0.254: SW3.1 SW2.1 SW1.1 49.35,88.41 v49.78,88.84
  Top 0.406: v71.88,88.96 R1.1
  Bottom 0.254: IC1.1 24.38,25.72 | C4.2 IC3.3 | R32.1 53.68,48.66 54.44,49.43 C14.2
  Bottom 0.305: 22.29,46.29 22.31,46.27
  Bottom 0.406: C7.2 52.71,64.9 52.71,62.86 53.72,61.85 | C2.2 C3.2 69.32,76.3 71.18,78.17 74.47,78.17 X2.GND 75.01,75.12 73.79,75.12 73.02,74.36 73.02,73.41 | IC2.32 U$3.32 IC6.32 38.29,9.78 35.24,6.73 10.73,6.73 8.7,8.76 8.7,11.62 | C14.2 56.39,50.74 57.15,51.5 57.15,59.63 54.93,61.85 53.72,61.85 | C13.1 52.74,60.87 53.72,61.85 | IC1.10 24.38,19.85 24.38,17.53 16.45,9.59 IC5.14 10.73,9.59 8.7,11.62 | C7.2 63.95,64.92 | v71.88,88.96 73.98,88.96 73.98,82.93 73.53,82.49 | C8.2 72.73,81.69 73.53,82.49 | 73.02,73.41 73.85,72.58 76.83,72.58 78.55,74.3 78.55,77.47 73.53,82.49 | 22.35,27.88 C5.2 | 22.35,27.88 24.38,27.88 | 24.38,27.88 25.15,27.88 26.92,26.1 32.45,26.1 | 58.46,85.28 58.46,85.03 | 58.46,85.03 C1.2 | 20.61,46.29 22.29,46.29 24.57,46.29 25.72,45.15 C6.2 27.34,46.08 29.46,48.2 30.16,48.2 31.88,46.48 31.88,39.94 | 22.35,27.88 22.35,33.53 27.62,38.8 30.73,38.8 31.88,39.94 | 58.29,73.85 57.59,74.55 57.59,77.34 59.05,78.8 59.75,78.8 61.47,80.52 IC4.5 61.47,82.87 62.42,83.82 62.42,84.58 61.79,85.22 58.52,85.22 58.46,85.28 | 58.29,73.85 59.94,73.85 60.83,74.74 IC4.13 | IC1.1 24.36,27.86 24.38,27.88 | 8.7,11.62 8.7,40.64 14.35,46.29 20.61,46.29 | IC7.3 58.03,71.63 57.59,72.07 57.59,73.15 58.29,73.85 | C7.2 63.92,66.52 64.9,67.5 C9.2 65.89,69.25 67.88,71.25 71.12,71.25 73.02,73.15 73.02,73.41 | 20.61,46.29 C4.2 | 58.46,85.28 58.46,87.84 56.13,90.17 51.12,90.17 v49.78,88.84 49.78,86.11 39.69,76.01 39.69,47.75 31.88,39.94 | 58.46,85.03 C10.2 55.71,84.29 55.5,84.07 55.18,84.07 54.86,83.76 54.86,82.3 55.01,82.15 IC8.3
  pour Bottom (isolate 0.254): 4.19,0 arc-90 0,4.19 0,94.04 arc-90 4.19,98.23 78.74,98.23 arc-90 82.93,94.04 82.93,4.19 arc-90 78.74,0
  pour Top (isolate 0.254): 4.19,0 arc-90 0,4.19 0,94.04 arc-90 4.19,98.23 78.74,98.23 arc-90 82.93,94.04 82.93,4.19 arc-90 78.74,0
I/!E
  Top 0.406: IC6.12 U$3.12 IC2.12
  Bottom 0.254: IC2.12 49.66,45.34 50.48,46.16 50.48,46.61 51.31,47.43 R32.2
IRL  (via drill 0.38)
  Top 0.254: IC2.5 49.59,57.78 49.91,57.47 49.91,46.35 v50.86,45.4
  Top 0.406: IC6.5 U$3.5 IC2.5
  Bottom 0.254: v50.86,45.4 R19.1
IRP  (via drill 0.38)
  Top 0.254: IC2.4 49.59,59.56 50.42,58.74 50.42,46.93 51.62,45.72 51.62,44.13 v50.86,43.37
  Top 0.406: IC6.4 U$3.4 IC2.4
  Bottom 0.254: v50.86,43.37 R18.1
IS/!RD
  Top 0.406: IC6.10 U$3.10 IC2.10
  Bottom 0.254: IC5.22 31.18,27.37 40.32,36.51 40.32,48.26 40.96,48.89 IC6.10
N$2
  pour Top: 2.54,88.27 36.32,88.27 36.32,85.15 2.54,85.15
N$3
  Bottom 0.254: IC4.9 63.37,77.22 64.13,77.98 R2.2
N$4
  Bottom 0.254: IC4.8 63.37,80.77 64.13,80.01 R3.2
N$5
  Bottom 0.254: C3.1 68.64,77.98 | 68.64,77.98 R2.1 | 68.64,77.98 69.41,77.98 70.17,78.74 75.69,78.74 77.41,77.02 77.41,75.76 76.77,75.12 75.95,75.12 75.25,74.42 75.25,73.98 75.14,73.87 X2.D-
N$6
  Bottom 0.254: R3.1 68.64,80.01 C8.1 69.43,79.99 70.17,79.25 75.88,79.25 77.91,77.22 77.91,75.52 X2.D+
N$7
  pour Top: 34.16,8.7 42.54,8.7 42.54,5.08 34.16,5.08
N$8  (via drill 0.38)
  Top 0.254: v79.25,54.86 79.25,53.85 PWR1.C
  Bottom 0.254: R23.2 78.23,53.85 v79.25,54.86
N$9
  Top 0.254: RX.C R4.2
N$10
  Top 0.254: TX.C R5.2
N$11  (via drill 0.38)
  Top 0.254: IC5.20 27.69,22.29 26.61,23.37 26.61,34.8 28.07,36.26 30.04,36.26 30.93,37.15 30.93,40.51 30.1,41.34 24.32,41.34 v23.69,41.97
  Bottom 0.254: v23.69,41.97 23.67,41.99 IC3.4
N$12
  Bottom 0.406: 66.8,74.32 FB1.1 66.8,73.15 67.4,72.56 C2.1 69.47,72.56 73.28,76.37 X2.VBUS
N$13
  Top 0.254: IC5.27 24.57,40.07 22.92,41.72 22.92,42.29 31.37,50.74 JP2.4
N$14  (via drill 0.38)
  Top 0.254: v79.25,56.9 79.25,55.88 PWR2.C
  Bottom 0.254: R22.2 78.23,55.88 v79.25,56.9
N$15  (via drill 0.38)
  Top 0.254: v79.25,58.93 79.25,57.91 PWR3.C
  Bottom 0.254: R21.2 78.23,57.91 v79.25,58.93
N$16  (via drill 0.38)
  Top 0.254: v79.25,60.96 79.25,59.94 PWR4.C
  Bottom 0.254: R20.2 78.23,59.94 v79.25,60.96
N$17
  Top 0.254: JP2.2 26.29,58.93 26.29,56.07 13.84,43.62 IC5.1
N$18
  pour Top: 14.41,5.14 14.41,1.46 70.68,1.46 70.68,5.14
N$19  (via drill 0.38)
  Top 0.254: v59.31,82.87 v59.31,87.06
  Bottom 0.254: IC4.2 59.56,82.68 59.5,82.68 v59.31,82.87 | JP3.3 58.17,91.12 59.82,89.47 60.2,89.47 60.58,89.09 60.58,88.33 v59.31,87.06
N$20
  Bottom 0.254: IC4.6 62.1,82.68 62.99,83.57 62.99,85.72 61.4,87.31 61.4,90.42 60.71,91.12 JP3.4
N$21  (via drill 0.38)
  Top 0.254: v59.56,77.72 60.96,79.12 60.96,83 60.32,83.63 60.32,86.23 v62.48,88.39
  Bottom 0.254: IC4.15 v59.56,77.72 | v59.56,77.72 | v62.48,88.39 63.25,89.15 JP3.5
N$43
  Top 0.254: PWR.C R1.2
OS/!WR
  Top 0.406: IC6.11 U$3.11 IC2.11
PC0
  Top 0.406: U$3.48 IC6.48
  Bottom 0.254: U$3.48 66.99,36.45 66.1,37.34 R24.2
PC1
  Top 0.406: U$3.47 IC6.47
  Bottom 0.254: U$3.47 66.99,34.67 66.36,35.31 R25.2
PC2
  Top 0.406: U$3.46 IC6.46
  Bottom 0.254: U$3.46 66.99,32.89 66.61,33.27 R26.2
PC3
  Top 0.406: U$3.45 IC6.45
  Bottom 0.254: U$3.45 66.99,31.11 66.87,31.24 R29.2
PC4
  Top 0.406: U$3.44 IC6.44
  Bottom 0.254: U$3.44 66.99,29.34 66.87,29.21 R27.2
PC5
  Top 0.406: U$3.43 IC6.43
  Bottom 0.254: U$3.43 66.99,27.56 66.61,27.18 R30.2
PC6
  Top 0.406: U$3.42 IC6.42
  Bottom 0.254: U$3.42 66.99,25.78 66.36,25.15 R28.2
PC7
  Top 0.406: U$3.41 IC6.41
  Bottom 0.254: U$3.41 66.99,24 66.1,23.11 R31.2
PD0  (via drill 0.38)
  Top 0.254: U$3.40 65.85,22.23 63.37,24.7 63.37,37.85 55.82,45.4 v54.8,45.4
  Top 0.406: U$3.40 IC6.40
  Bottom 0.254: v54.8,45.4 R19.2
PD1  (via drill 0.38)
  Top 0.254: U$3.39 66.87,20.45 62.86,24.45 62.86,37.59 57.09,43.37 v54.8,43.37
  Top 0.406: U$3.39 IC6.39
  Bottom 0.254: v54.8,43.37 R18.2
PD2
  Top 0.406: U$3.38 IC6.38
PD3
  Top 0.406: U$3.37 IC6.37
SIN0  (via drill 0.38)
  Top 0.254: v47.88,80.45 47.88,79.44 46.48,78.04 v45.21,78.04
  Top 0.406: IC2.17 U$3.17 IC6.17
  Bottom 0.254: U$3.17 46.67,36.45 45.4,37.72 45.4,77.85 v45.21,78.04 | IC8.4 53.45,82.15 51.75,80.45 v47.88,80.45
SIN1
  Top 0.406: IC6.16 U$3.16 IC2.16
SIN2
  Top 0.406: IC6.15 U$3.15 IC2.15
SIN3
  Top 0.406: IC6.14 U$3.14 IC2.14
SOUT0  (via drill 0.38)
  Top 0.254: v47.18,79.76 45.91,79.76 v45.21,79.06 | v60.26,80.39 60.26,83 59.82,83.44 59.82,86.49 60.07,86.74 60.07,87.38 59.82,87.63 v59.82,88.71
  Top 0.406: IC2.19 U$3.19 IC6.19
  Bottom 0.254: IC4.4 60.83,80.96 v60.26,80.39 59.82,79.95 48.32,79.95 48.13,79.76 v47.18,79.76 | U$3.19 46.61,32.89 44.89,34.61 44.89,77.41 44.58,77.72 44.58,78.42 v45.21,79.06 | JP3.2 55.63,92.9 v59.82,88.71
SOUT1
  Top 0.406: IC6.18 U$3.18 IC2.18
TXD  (via drill 0.38)
  Top 0.254: v57.02,82.8 56.64,83.19 56.64,84.2 56.83,84.39 56.83,87.38 58.17,88.71 v58.17,89.34
  Bottom 0.254: IC4.1 58.37,81.77 57.34,82.8 v57.02,82.8 IC8.2 | v58.17,89.34 54.36,93.16 54.36,94.93 53.91,95.38 JP3.1
VCC  (via drill 0.38)  (2 unrouted)
  Top 0.254: PWR4.A
  Top 0.406: U$3.64 IC6.64 76.45,64.9 80.77,60.58 PWR4.A | R8.1 R7.1 R6.1 55.78,88.75 v55.69,88.84 | PWR4.A PWR3.A PWR2.A PWR1.A 80.77,53.84 v80.77,52.77 | 55.78,71.1 57.4,69.47 v61.72,69.47 v65.15,66.04 | v29.08,46.29 37.72,54.93 37.72,59.37 | 37.72,59.37 37.72,59.82 | 37.72,59.82 37.72,60.26 | 37.72,60.26 37.72,81.72 48.26,92.27 65.28,92.27 69.61,87.94 69.61,87.95 v77.85,87.95 PWR.A | JP2.1 JP1.2 | 37.72,59.82 37.27,59.82 | 37.27,59.82 JP2.5 | 37.72,59.37 37.27,59.82 | 37.27,59.82 37.72,60.26
  Bottom 0.254: C4.1 22.31,42.89 22.04,42.61 21.72,42.61 21.46,42.35 21.46,41.02 21.8,40.69 IC3.5 23.57,40.69 24.61,39.66 | 24.32,39.37 24.32,39.94 24.89,39.94
  Bottom 0.305: 21.4,36.45 21.46,36.51
  Bottom 0.406: IC1.20 18.56,26.82 19.62,27.88 C5.1 20.64,27.9 20.64,35.69 21.4,36.45 24.32,39.37 24.61,39.66 24.89,39.94 27.56,42.61 IC5.28 | IC5.28 | U$3.64 C7.1 65.62,65.57 v65.15,66.04 | IC5.28 29.08,45.11 C6.1 29.08,45.19 v29.08,46.29 | IC6.64 73.53,67.56 79.25,73.28 79.25,77.6 76.71,80.14 76.71,82.17 77.85,83.31 v77.85,87.95 | IC7.6 61.72,71.63 61.72,70.33 | 61.72,70.33 IC7.8 | v61.72,69.47 61.72,70.33 | JP2.1 23.75,58.1 24.19,57.66 33.53,57.66 33.91,58.04 JP2.5 | C10.1 IC8.5 53.07,83.45 51.82,84.71 51.82,87.76 53.21,89.15 55.37,89.15 v55.69,88.84 | R36.1 R35.1 R34.1 R33.1 80.14,52.13 v80.77,52.77
VCC_3V3  (via drill 0.38)
  Top 0.254: 62.74,82.49 66.17,85.91 v67.25,85.91 | v71.82,85.91 77.84,85.91
  Top 0.305: v61.34,83.88 62.74,82.49 v62.74,78.17
  Top 0.406: RX.A 77.84,85.91 TX.A 78.49,86.93 78.93,87.38 78.93,89.47 78.42,89.98 76.77,89.98 74.61,92.14 74.61,95.69 72.83,97.47 50.1,97.47 JP4.1
  Bottom 0.254: IC4.3 60.2,83.84 C1.1 | v67.25,85.91 v71.82,85.91
  Bottom 0.305: IC4.10 v62.74,78.17 | v62.74,78.17 | v61.34,83.88 C1.1 | IC4.11 62.1,75.06 62.74,75.06 IC4.10 | IC4.10
VCC_USB
  Bottom 0.406: IC4.12 61.47,74.11 FB1.2 C9.1 62.95,70.95 IC7.7
XIN
  Top 0.406: IC6.6 U$3.6 IC2.6
  Bottom 0.406: IC2.6 50.23,56.01 51.12,55.12 54.29,55.12 54.79,55.62 X1.1 54.79,59.15 C13.2
XOUT
  Top 0.406: IC6.7 U$3.7 IC2.7
  Bottom 0.406: IC2.7 49.85,54.23 50.86,53.22 X1.3 52.39,51.09 C14.1

### Text on the board
Top: TCCS Reader Rev B | Copyright 2014, Jon Hacker & Jon Sole
tPlace: 3v3 | TX | RX | RTS | CTS | CB0 | CB1 | CB2 | CB3 | NMI | HALT | INIT | Fit jumpers labelled 27 for 27C256, 27SF256 | or 29C256 | Fit jumpers labelled 28 for 28C256 | 5V | GND | 27 | 28 | 27 | 28
tNames: ASR1 | VCC | ASR0 | ASR2 | !NMI | ASR3 | IRP | DOUT0 | IRL | DOUT1 | DOUT2 | DOUT3 | CCLK | DOUT4 | ADR | DOUT5 | IS/!RD | DOUT6 | OS/!WR | DOUT7 | I/!E | WDC | CLK | !INIT | SIN3 | !HALT | SIN2 | !WI | SIN1 | !TEST | SIN0 | PC0 | SOUT1 | PC1 | SOUT0 | PC2 | PB7/DA7 | PC3 | PB6/DA6 | PC4 | PB5/DA5 | PC5 | PB4/DA4 | PC6 | PB3/DA3 | PC7 | PB2/DA2 | PD0 | PB1/DA1 | PD1 | PB0/DA0 | PD2 | PA7/A15 | PD3 | PA6/A14 | PA0/A8 | PA5/A13 | PA1/A9 | PA4/A12 | PA2/A10 | GND | PA3/A11
tStop: TCCS Reader Rev B | Copyright 2014, Jon Hacker & Jon Sole